# Altium schematic sheet schematic.SchDoc
size A2
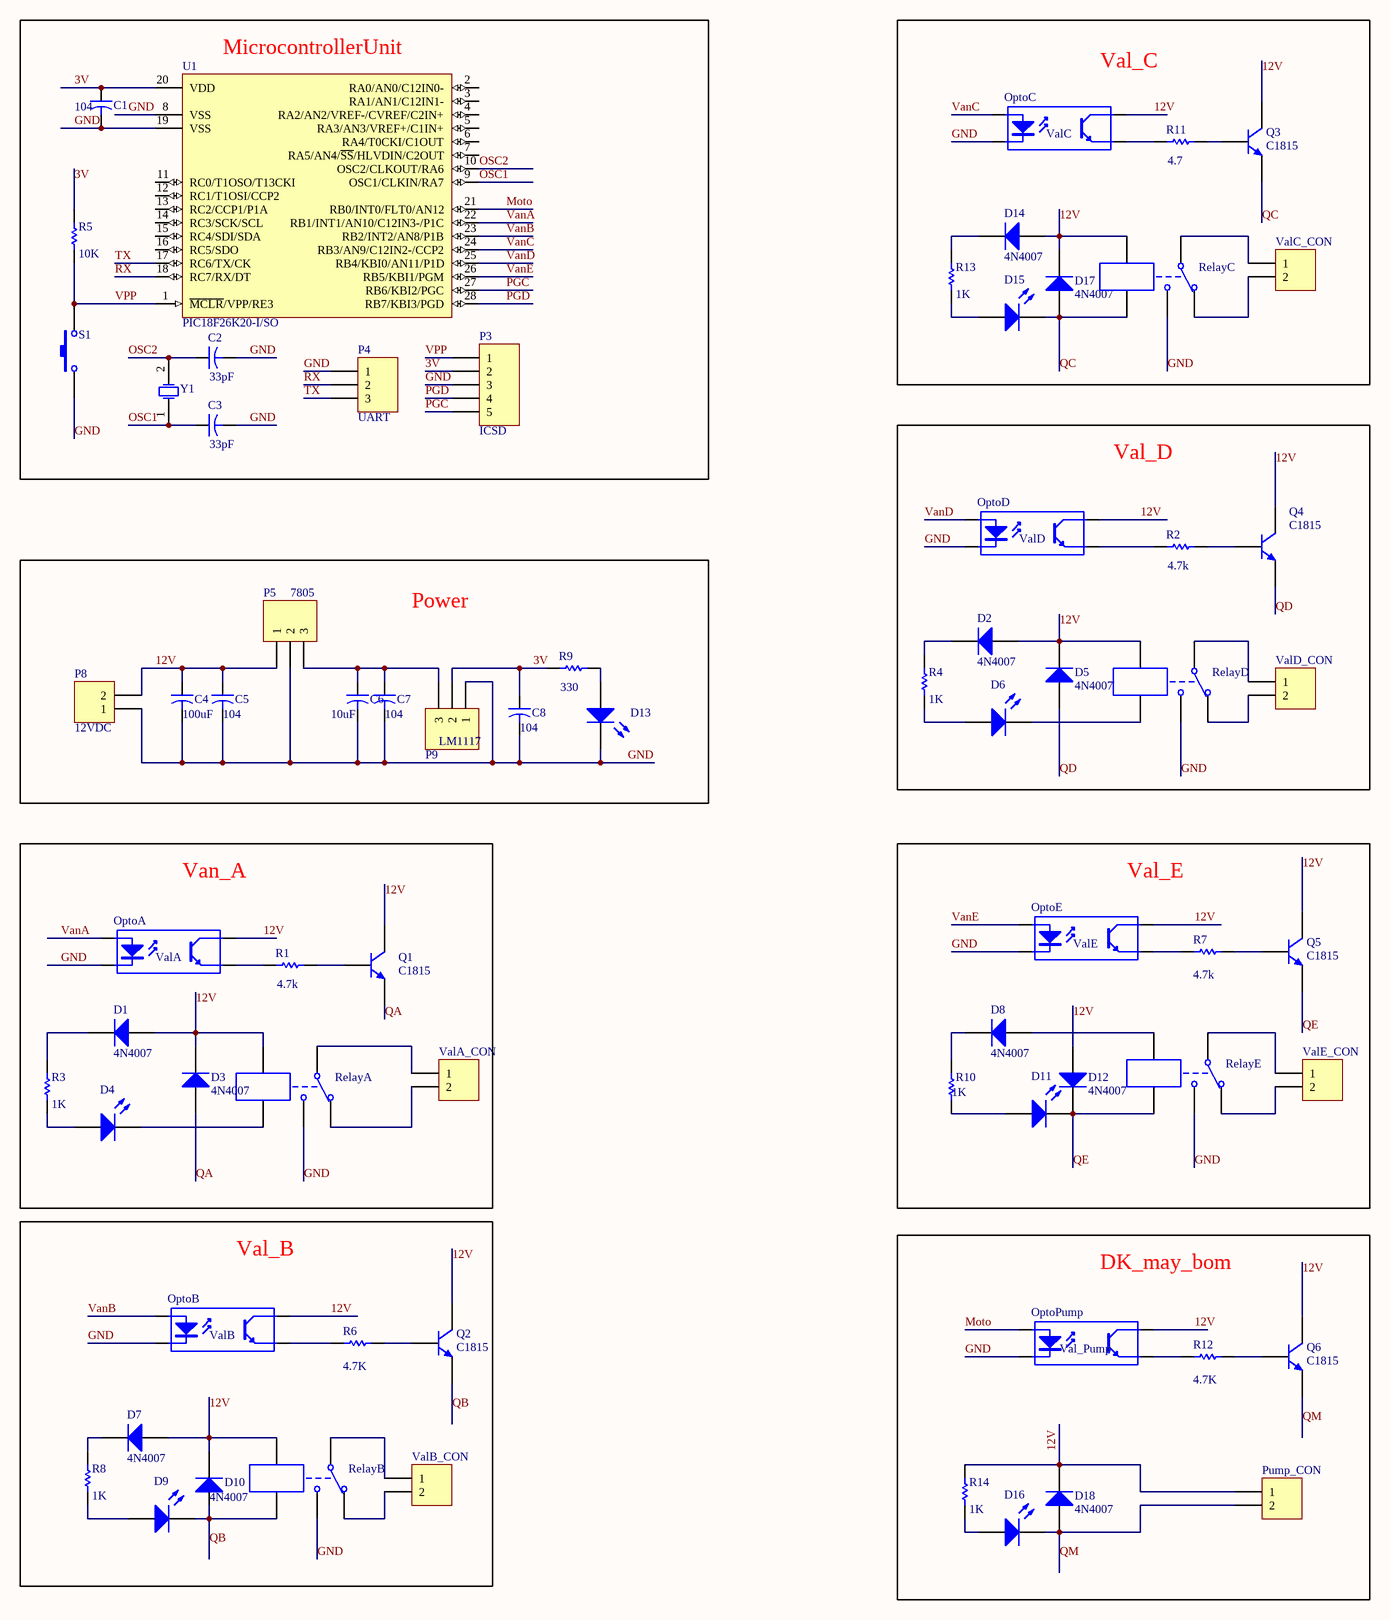
[diagram p0: schematic.SchDoc]

## Parts
C1  value 104  [CN1]  (hidden comment: Cap2)
C2  value 33pF  [CN1]  (hidden comment: Cap2)
C3  value 33pF  [CN1]  (hidden comment: Cap2)
C4  value 100uF  [CP1.5/2.5]  (hidden comment: Cap2)
C5  value 104  [CN1]  (hidden comment: Cap2)
C6  value 10uF  [CP1/2]  (hidden comment: Cap2)
C7  value 104  [CN1]  (hidden comment: Cap2)
C8  value 104  [CN1]  (hidden comment: Cap2)
D1  4N4007  [D2A]
D2  4N4007  [D2A]
D3  4N4007  [D2A]
D4  LED1  [LED-5TRED]  (value not drawn)
D5  4N4007  [D2A]
D6  LED1  [LED-5TRED]  (value not drawn)
D7  4N4007  [D2A]
D8  4N4007  [D2A]
D9  LED1  [LED-5TRED]  (value not drawn)
D10  4N4007  [D2A]
D11  LED1  [LED-5TRED]  (value not drawn)
D12  4N4007  [D2A]
D13  LED1  [LED-5TRED]  (value not drawn)
D14  4N4007  [D2A]
D15  LED1  [LED-5TRED]  (value not drawn)
D16  LED1  [LED-5TRED]  (value not drawn)
D17  4N4007  [D2A]
D18  4N4007  [D2A]
OptoA  ValA  [DIP4/W0.3]
OptoB  ValB  [DIP4/W0.3]
OptoC  ValC  [DIP4/W0.3]
OptoD  ValD  [DIP4/W0.3]
OptoE  ValE  [DIP4/W0.3]
OptoPump  Val_Pump  [DIP4/W0.3]
P3  ICSD  [JP5]
P4  UART  [JP3]
P5  7805  [JP3]
P8  12VDC  [DC-IN]
P9  LM1117  [JP3]
Pump_CON  Header 2  [CON2]  (value not drawn)
Q1  C1815  [QTO-92]
Q2  C1815  [QTO-92]
Q3  C1815  [QTO-92]
Q4  C1815  [QTO-92]
Q5  C1815  [QTO-92]
Q6  C1815  [QTO-92]
R1  value 4.7k  [R1/4W]  (hidden comment: Res1)
R2  4.7k  [R1/4W]
R3  value 1K  [R1/4W]  (hidden comment: Res1)
R4  value 1K  [R1/4W]  (hidden comment: Res1)
R5  value 10K  [R1/4W]  (hidden comment: Res1)
R6  value 4.7K  [R1/4W]  (hidden comment: Res1)
R7  value 4.7k  [R1/4W]  (hidden comment: Res1)
R8  value 1K  [R1/4W]  (hidden comment: Res1)
R9  value 330  [R1/4W]  (hidden comment: Res1)
R10  value 1K  [R1/4W]  (hidden comment: Res1)
R11  value 4.7  [R1/4W]  (hidden comment: Res1)
R12  value 4.7K  [R1/4W]  (hidden comment: Res1)
R13  value 1K  [R1/4W]  (hidden comment: Res1)
R14  value 1K  [R1/4W]  (hidden comment: Res1)
RelayA  Relay-SPDT  [RL_SPDT_10A]  (value not drawn)
RelayB  Relay-SPDT  [RL_SPDT_10A]  (value not drawn)
RelayC  Relay-SPDT  [RL_SPDT_10A]  (value not drawn)
RelayD  Relay-SPDT  [RL_SPDT_10A]  (value not drawn)
RelayE  Relay-SPDT  [RL_SPDT_10A]  (value not drawn)
S1  SW-PB  [SW2]  (value not drawn)
U1  PIC18F26K20-I/SO  [SOP_28M_127]
ValA_CON  Header 2  [CON2]  (value not drawn)
ValB_CON  Header 2  [CON2]  (value not drawn)
ValC_CON  Header 2  [CON2]  (value not drawn)
ValD_CON  Header 2  [CON2]  (value not drawn)
ValE_CON  Header 2  [CON2]  (value not drawn)
Y1  8Mhz  [XT2]  (value not drawn)

## Blocks framed on the sheet
MicrocontrollerUnit: C1-C3 P3 P4 R5 S1 U1 Y1
Val_C: D14 D15 D17 OptoC Q3 R11 R13 RelayC ValC_CON
Val_D: D2 D5 D6 OptoD Q4 R2 R4 RelayD ValD_CON
Power: C4-C8 D13 P5 P8 P9 R9
Van_A: D1 D3 D4 OptoA Q1 R1 R3 RelayA ValA_CON
Val_E: D8 D11 D12 OptoE Q5 R7 R10 RelayE ValE_CON
Val_B: D7 D9 D10 OptoB Q2 R6 R8 RelayB ValB_CON
DK_may_bom: D16 D18 OptoPump Pump_CON Q6 R12 R14

## Nets
3V: C1.1 C8.1 P3.2 P9.2 R5.2 R9.1 U1.20(VDD)
12V: C4.1 C5.1 D1.1(A) D2.1(A) D3.2(K) D5.2(K) D7.1(A) D10.2(K) D12.1(A) D14.1(A) D17.2(K) D18.2(K) OptoA.4(C) OptoB.4(C) OptoC.4(C) OptoD.4(C) OptoE.4(C) OptoPump.4(C) P5.1 P8.2 Pump_CON.1 Q1.3(C) Q2.3(C) Q3.3(C) Q4.3(C) Q5.3(C) Q6.3(C) R14.1 RelayA.4 RelayB.4 RelayC.4 RelayD.4
GND: C1.2 C2.2 C3.2 C4.2 C5.2 C6.2 C7.2 C8.2 D13.2(K) OptoA.2(K) OptoB.2(K) OptoC.2(K) OptoD.2(K) OptoE.2(K) OptoPump.2(K) P3.3 P4.1 P5.2 P8.1 P9.1 RelayA.3 RelayB.3 RelayC.3 RelayD.3 RelayE.3 S1.1 U1.8(VSS) U1.19(VSS)
Moto: OptoPump.1(A) U1.21(RB0/INT0/FLT0/AN12)
OSC1: C3.1 U1.9(OSC1/CLKIN/RA7) Y1.1(OSC1)
OSC2: C2.1 U1.10(OSC2/CLKOUT/RA6) Y1.2(OSC2)
PGC: P3.5 U1.27(RB6/KBI2/PGC)
PGD: P3.4 U1.28(RB7/KBI3/PGD)
QA: D3.1(A) Q1.1(E)
QB: D9.2(K) D10.1(A) Q2.1(E) RelayB.5
QC: D15.2(K) D17.1(A) Q3.1(E) RelayC.5
QD: D5.1(A) Q4.1(E)
QE: D11.2(K) D12.2(K) Q5.1(E) RelayE.5
QM: D16.2(K) D18.1(A) Pump_CON.2 Q6.1(E)
RX: P4.2 U1.18(RC7/RX/DT)
TX: P4.3 U1.17(RC6/TX/CK)
VanA: OptoA.1(A) U1.22(RB1/INT1/AN10/C12IN3-/P1C)
VanB: OptoB.1(A) U1.23(RB2/INT2/AN8/P1B)
VanC: OptoC.1(A) U1.24(RB3/AN9/C12IN2-/CCP2)
VanD: OptoD.1(A) U1.25(RB4/KBI0/AN11/P1D)
VanE: OptoE.1(A) U1.26(RB5/KBI1/PGM)
VPP: P3.1 R5.1 S1.2 U1.1(~{MCLR}/VPP/RE3)
NetC6_1: C6.1 C7.1 P5.3 P9.3
NetD1_2: D1.2(K) R3.1
NetD2_2: D2.2(K) R4.1
NetD4_1: D4.1(A) R3.2
NetD4_2: D4.2(K) RelayA.5
NetD6_1: D6.1(A) R4.2
NetD6_2: D6.2(K) RelayD.5
NetD7_2: D7.2(K) R8.1
NetD8_1: D8.1(A) RelayE.4
NetD8_2: D8.2(K) R10.1
NetD9_1: D9.1(A) R8.2
NetD11_1: D11.1(A) R10.2
NetD13_1: D13.1(A) R9.2
NetD14_2: D14.2(K) R13.1
NetD15_1: D15.1(A) R13.2
NetD16_1: D16.1(A) R14.2
NetOptoA_3: OptoA.3(E) R1.1
NetOptoB_3: OptoB.3(E) R6.1
NetOptoC_3: OptoC.3(E) R11.1
NetOptoD_3: OptoD.3(E) R2.1
NetOptoE_3: OptoE.3(E) R7.1
NetOptoPump_3: OptoPump.3(E) R12.1
NetQ1_2: Q1.2(B) R1.2
NetQ2_2: Q2.2(B) R6.2
NetQ3_2: Q3.2(B) R11.2
NetQ4_2: Q4.2(B) R2.2
NetQ5_2: Q5.2(B) R7.2
NetQ6_2: Q6.2(B) R12.2
NetRelayA_1: RelayA.1 ValA_CON.1
NetRelayA_2: RelayA.2 ValA_CON.2
NetRelayB_1: RelayB.1 ValB_CON.1
NetRelayB_2: RelayB.2 ValB_CON.2
NetRelayC_1: RelayC.1 ValC_CON.1
NetRelayC_2: RelayC.2 ValC_CON.2
NetRelayD_1: RelayD.1 ValD_CON.1
NetRelayD_2: RelayD.2 ValD_CON.2
NetRelayE_1: RelayE.1 ValE_CON.1
NetRelayE_2: RelayE.2 ValE_CON.2

Not connected (* = marked no-connect by the designer): U1 2(RA0/AN0/C12IN0-) 3(RA1/AN1/C12IN1-) 4(RA2/AN2/VREF-/CVREF/C2IN+) 5(RA3/AN3/VREF+/C1IN+) 6(RA4/T0CKI/C1OUT) 7(RA5/AN4/~{SS}/HLVDIN/C2OUT) 11(RC0/T1OSO/T13CKI) 12(RC1/T1OSI/CCP2) 13(RC2/CCP1/P1A) 14(RC3/SCK/SCL) 15(RC4/SDI/SDA) 16(RC5/SDO)

## Library data of the parts
C1-C8 = Cap2: Capacitor; Published: 23-Sep-2002; PackageReference: CAPR5-4X5; Publisher: Altium Limited; PackageDescription: Capacitor; 2 Leads
D1-D3 D5 D7 D8 D10 D12 D14 D17 D18 = Diode 1N4007: 1 Amp General Purpose Rectifier; Published: 8-Jun-2000; LatestRevisionDate: 17-Jul-2002; LatestRevisionNote: Re-released for DXP Platform.; DatasheetVersion: 1998; PackageVersion: Aug-1999; PackageReference: DO-41; Publisher: Altium Limited; PackageDescription: Diode, Axial; Body 5.2 x 2.7 mm (LxDia. max), Lead Dia. 0.86 mm (max); Code_JEDEC: DO-204-AL; ComponentLink1Description: Manufacturer Link; ComponentLink1URL: http://www.fairchildsemi.com/; ComponentLink2Description: Datasheet; ComponentLink2URL: http://www.fairchildsemi.com/ds/1N%2F1N4001.pdf
D4 D6 D9 D11 D13 D15 D16 = LED1: Typical RED GaAs LED; Published: 8-Jun-2000; LatestRevisionDate: 08-Jul-2005; LatestRevisionNote: Mech Layer 1 removed.; PackageReference: LED-1; Publisher: Altium Limited; PackageDescription: LED; 2 Leads
OptoA OptoB OptoC OptoD OptoE OptoPump = Optoisolator1: 4-Pin Phototransistor Optocoupler; Published: 24-Mar-1999; LatestRevisionDate: 04-Mar-2005; LatestRevisionNote: Sch pins 3 & 4 Swapped.; DatasheetVersion: Nov-2003; PackageReference: DIP-4; Publisher: Altium Limited
P3 = Header 5H: Header, 5-Pin, Right Angle; LatestRevisionDate: 17-Jul-2002; LatestRevisionNote: Re-released for DXP Platform.; Publisher: Altium Limited
P4 P5 P9 = Header 3H: Header, 3-Pin, Right Angle; LatestRevisionDate: 17-Jul-2002; LatestRevisionNote: Re-released for DXP Platform.; Publisher: Altium Limited
P8 Pump_CON ValA_CON ValB_CON ValC_CON ValD_CON ValE_CON = Header 2: Header, 2-Pin; LatestRevisionDate: 17-Jul-2002; LatestRevisionNote: Re-released for DXP Platform.; Publisher: Altium Limited
Q1-Q6 = 2N3904: NPN General Purpose Amplifier; Published: 8-Jun-2000; LatestRevisionDate: 15-Jan-2003; LatestRevisionNote: PCB Footprint 'BCY-W3/D4.7' replaced; DatasheetVersion: 1997; PackageVersion: Sep-1998; PackageReference: TO-92A; Publisher: Altium Limited; PackageDescription: TO, Flat Index; 3 In-Line, Axial Leads; Body Dia. 4.5mm; Leads 0.51 x 0.48 mm (max); ComponentLink1Description: Manufacturer Link; ComponentLink1URL: http://www.fairchildsemi.com/; ComponentLink2Description: Datasheet; ComponentLink2URL: http://www.fairchildsemi.com/ds/2N%2F2N3904.pdf
R1-R14 = Res1: Resistor; Published: 8-Jun-2000; LatestRevisionDate: 17-Jul-2002; LatestRevisionNote: Re-released for DXP Platform.; PackageReference: AXIAL-0.3; Publisher: Altium Limited; PackageDescription: Axial Device, Thru-Hole; 2 Leads; 0.3 in Pin Spacing
  R2: Value: 4.7k
RelayA RelayB RelayC RelayD RelayE = Relay-SPDT: Single-Pole Dual-Throw Relay; Published: 24-Mar-1999; LatestRevisionDate: 17-Jul-2002; LatestRevisionNote: Re-released for DXP Platform.; PackageReference: MODULE5B; Publisher: Altium Limited
S1 = SW-PB: Switch; Published: 24-Mar-1999; LatestRevisionDate: 17-Jul-2002; LatestRevisionNote: Re-released for DXP Platform.; PackageReference: SPST-2; Publisher: Altium Limited; PackageDescription: Switch; 2 Leads
U1 = PIC18F26K20-I/SO: Flash Microcontroller with 10-Bit A/D and nanoWatt Technology, 64K Flash, 28-Pin SOIC, Industrial Temperature Range; FirstPublished: 29-Jan-2009; LatestRevisionDate: 02-Dec-2009; LatestRevisionNote: Updated to datasheet revision F, Sep-2009; DatasheetVersion: revF, Sep-2009; PackageVersion: revBB, Aug-2009; PackageReference: SOIC-SO28; Publisher: Altium Limited; PackageDescription: 28-Lead Plastic Small Outline (SO) - Wide 7.50mm Body [SOIC]; Supplier 1: Digi-Key; Supplier Part Number 1: PIC18F26K20-I/SO-ND; Supplier 2: Farnell; Supplier Part Number 2: 1439580; Code_JEDEC: MS-013; ComponentLink1Description: Datasheet; ComponentLink1URL: http://ww1.microchip.com/downloads/en/DeviceDoc/41303F.pdf; ComponentLink2Description: Packaging Specification; ComponentLink2URL: http://www.microchip.com/stellent/groups/techpub_sg/documents/packagingspec/en012702.pdf; ComponentLink3Description: Microchip.com Home; ComponentLink3URL: http://www.microchip.com/; Supplier 3: Newark; Supplier Part Number 3: 88K6005
Y1 = XTAL: Crystal Oscillator; Published: 8-Jun-2000; LatestRevisionDate: 17-Jul-2002; LatestRevisionNote: Re-released for DXP Platform.; PackageReference: R38; Publisher: Altium Limited; PackageDescription: Crystal, Thru-Hole; 2 Leads; Body 3.1 x 8.2 mm (Dia.xH)